# Altium schematic sheet Block_Diagram_02.SchDoc
size A4; SheetNumber: 3; SheetTotal: 14
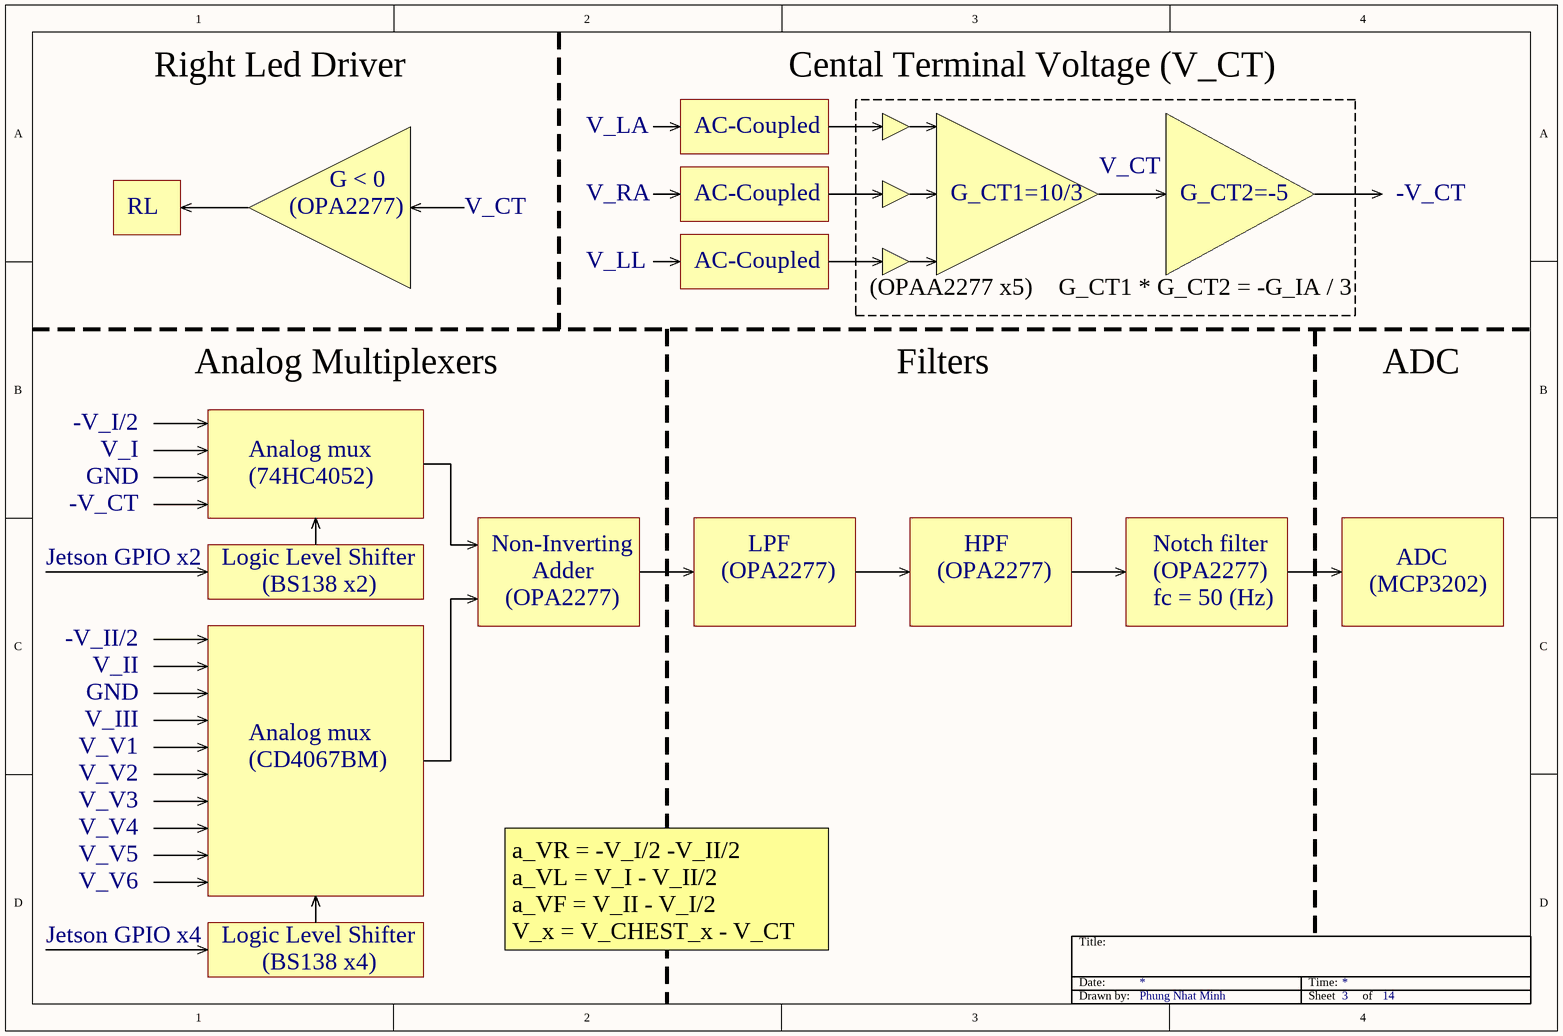
[diagram p0: Block_Diagram_02.SchDoc]

## Notes on the sheet
- Right Led Driver
- Cental Terminal Voltage (V_CT)
- V_LA
- AC-Coupled
- V_CT
- RL
- (OPA2277)
- G < 0
- V_RA
- G_CT1=10/3
- G_CT2=-5
- -V_CT
- V_LL
- (OPAA2277 x5)
- G_CT1 * G_CT2 = -G_IA / 3
- Analog Multiplexers
- Filters
- ADC
- -V_I/2
- V_I
- GND
- Analog mux
- (74HC4052)
- Jetson GPIO x2
- Logic Level Shifter
- Non-Inverting
- Adder
- LPF
- HPF
- Notch filter
- -V_II/2
- (BS138 x2)
- fc = 50 (Hz)
- (MCP3202)
- V_II
- V_III
- V_V1
- V_V2
- (CD4067BM)
- V_V3
- V_V4
- V_V5
- V_V6
- Jetson GPIO x4
- (BS138 x4)
- a_VR = -V_I/2 -V_II/2
  a_VL = V_I - V_II/2
  a_VF = V_II - V_I/2
  V_x = V_CHEST_x - V_CT
- Title:
- Date:
- Time:
- Drawn by:
- Phung Nhat Minh
- Sheet
- of